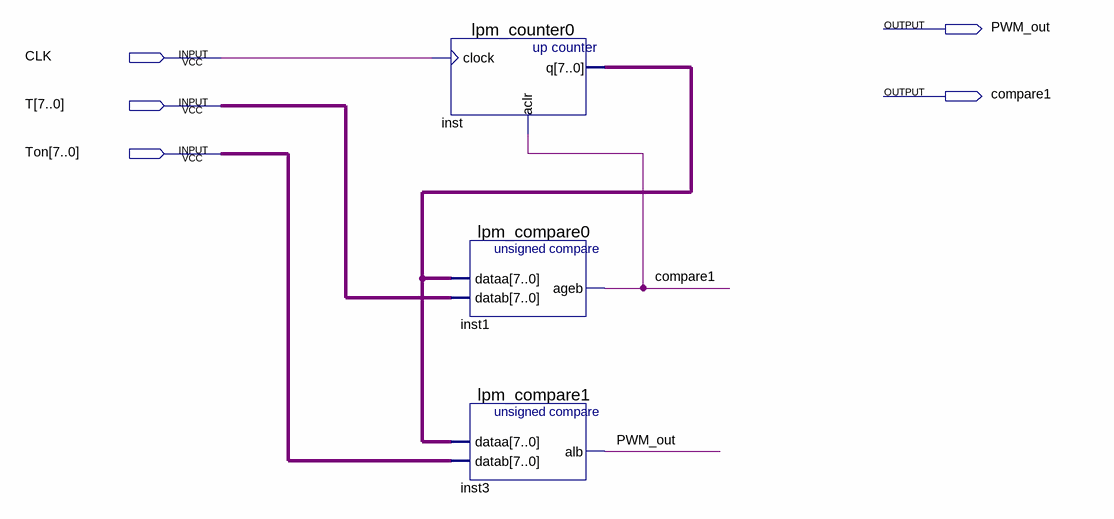
[diagram p0: schematic sheet]
// Quartus schematic PWM.bdf as structural Verilog: 3 symbols, 5 pins
module PWM (
  input  CLK,
  input  [7:0] T,
  input  [7:0] Ton,
  output PWM_out,
  output compare1
);

  wire [7:0] inst_q;

  lpm_counter0 inst (.clock(CLK), .aclr(compare1), .q(inst_q));
  lpm_compare0 inst1 (.dataa(inst_q), .datab(T), .ageb(compare1));
  lpm_compare1 inst3 (.dataa(inst_q), .datab(Ton), .alb(PWM_out));
endmodule
